# Altium project wifi-module-v02.PrjPcb (part 1 of 2)
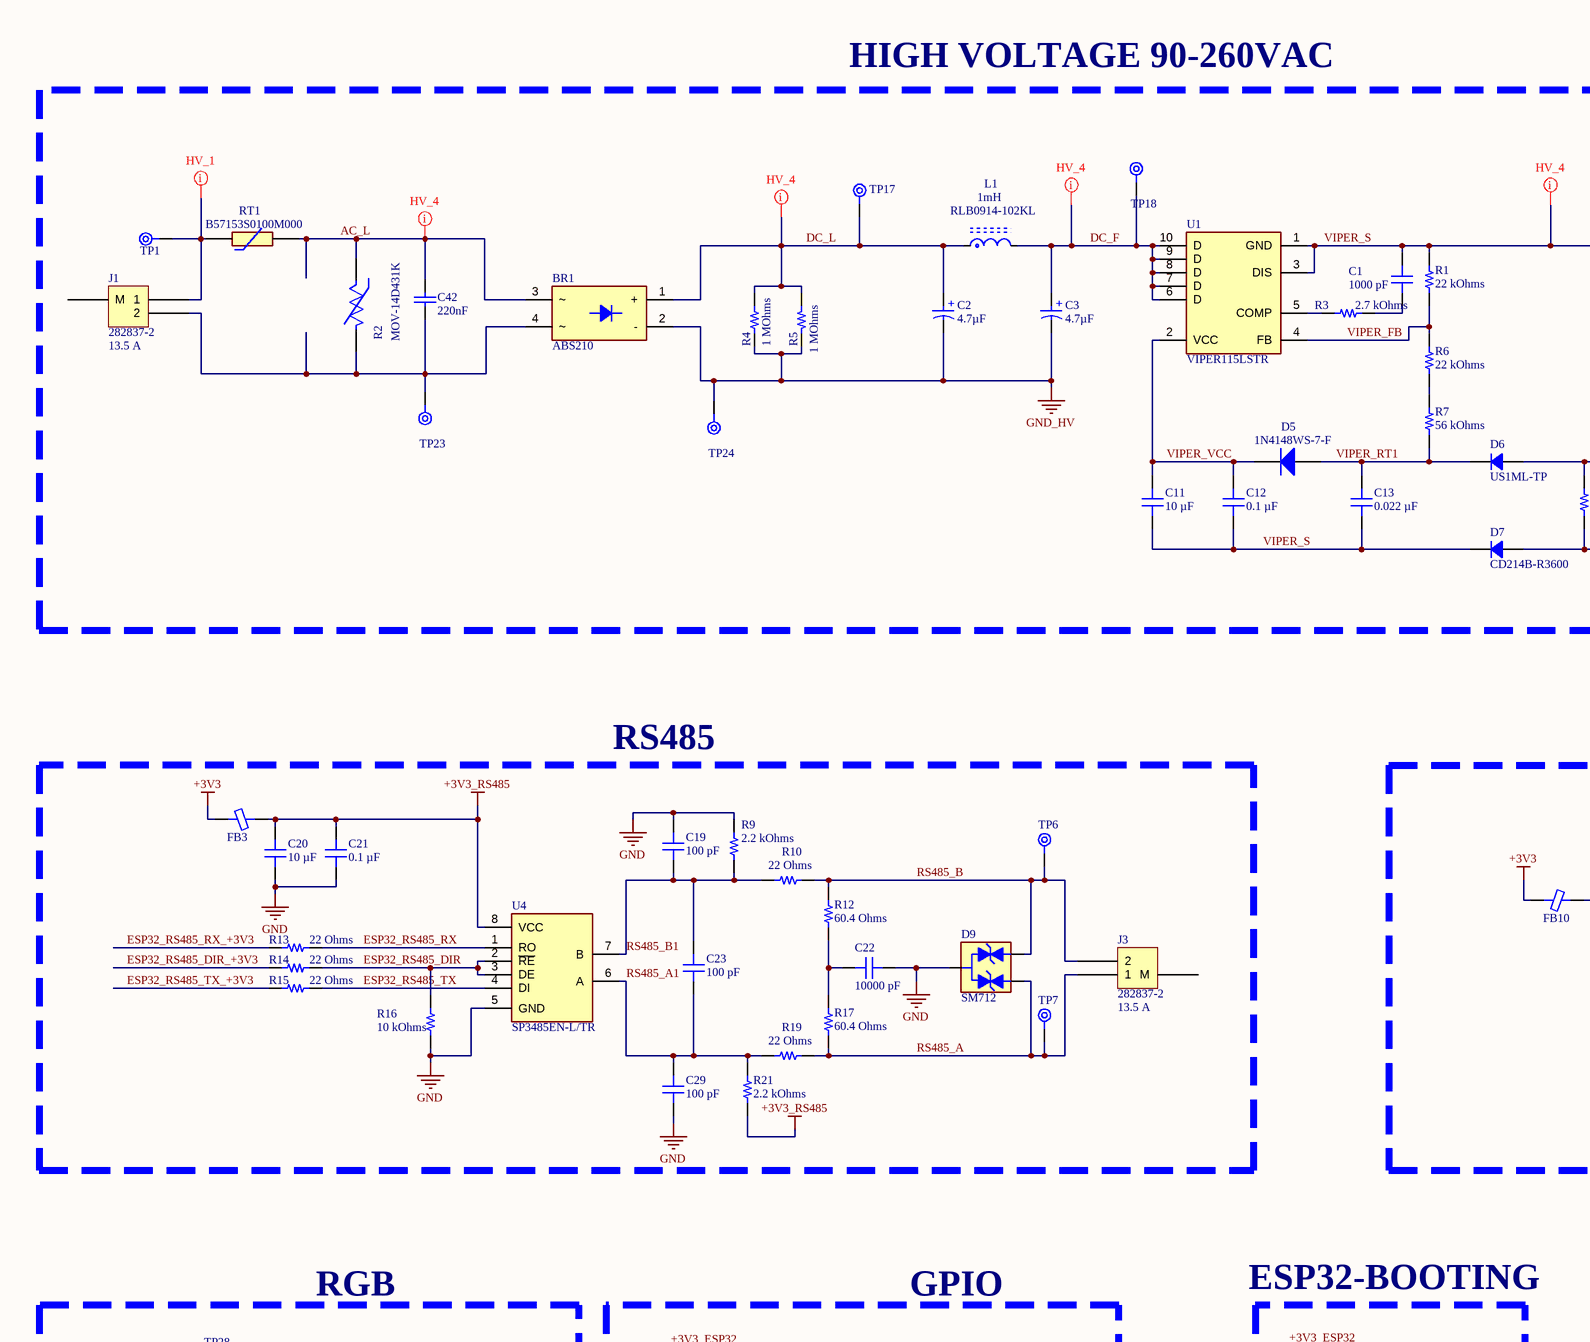
[diagram p0: wifi-module.SchDoc, top left]
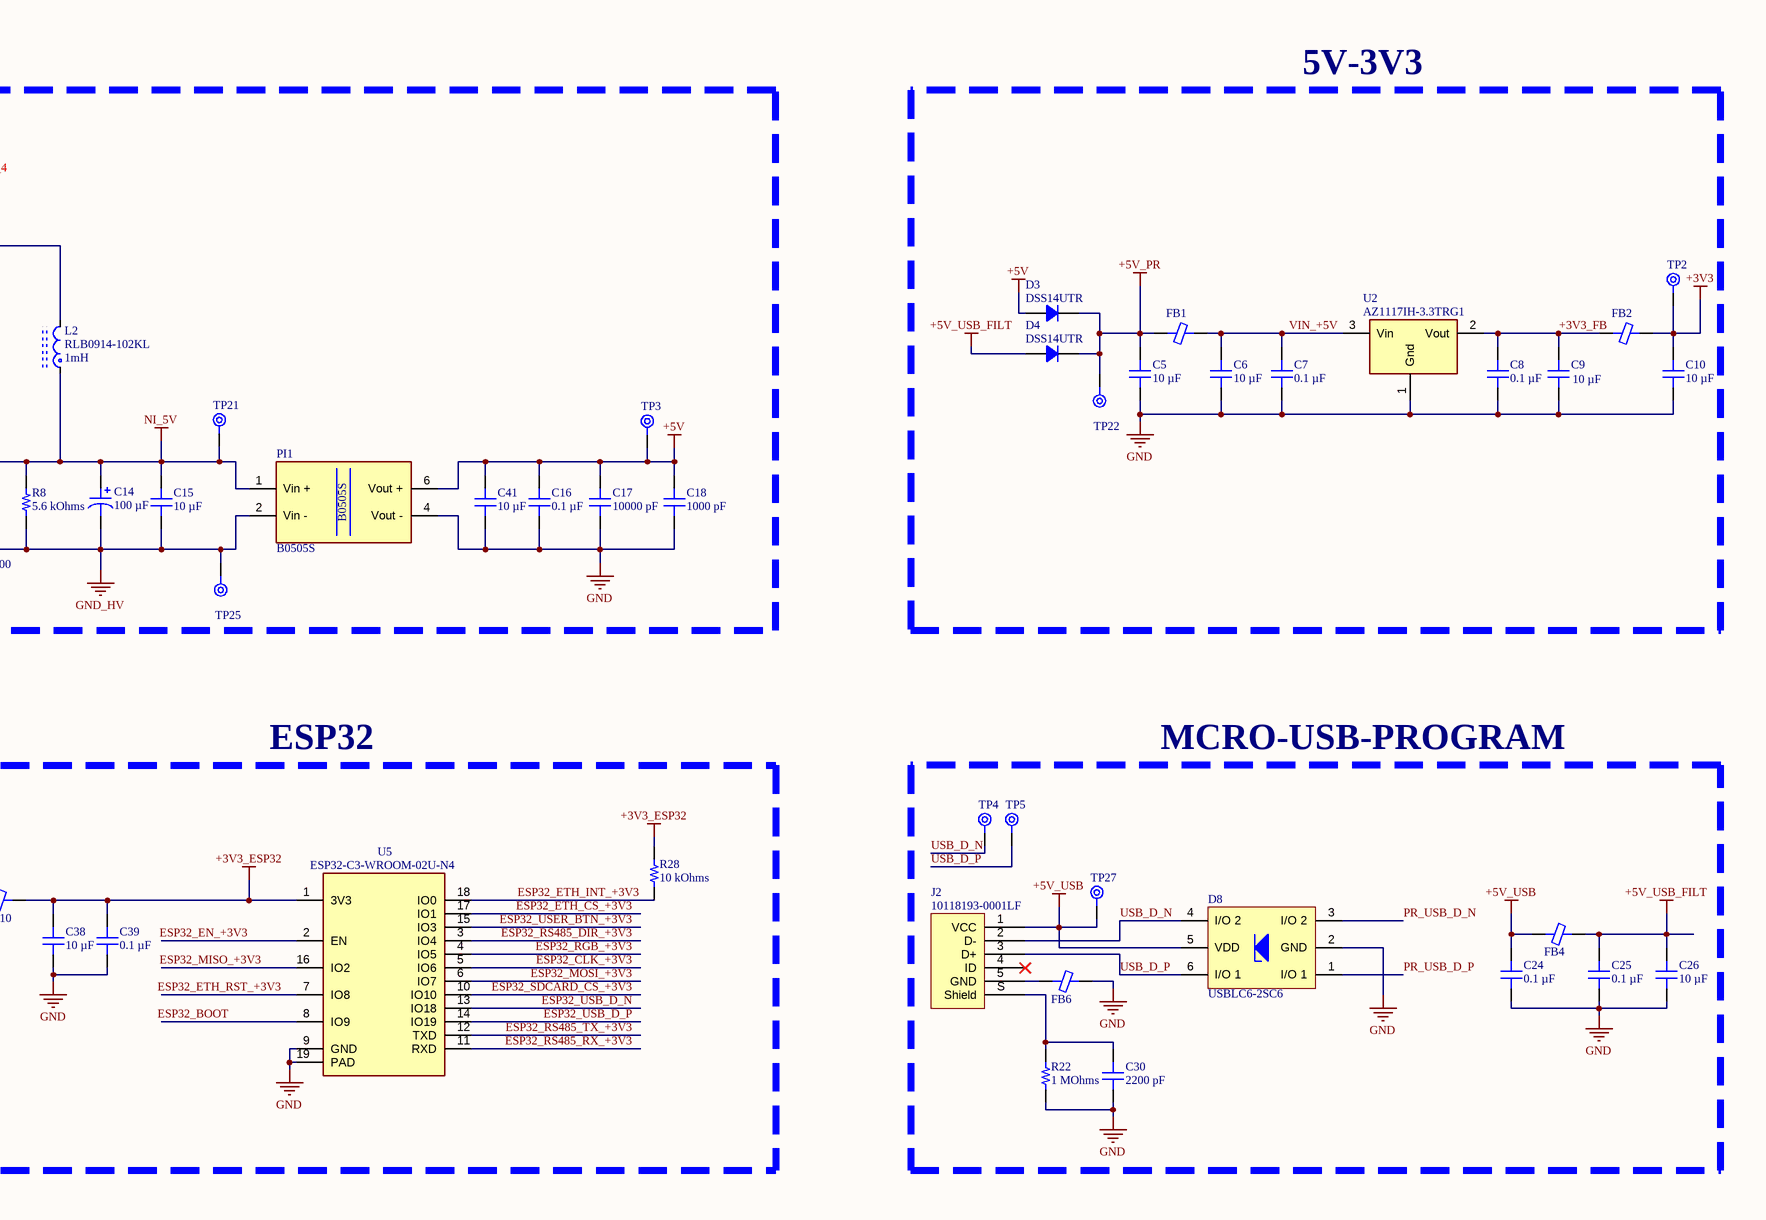
[diagram p1: wifi-module.SchDoc, top right]
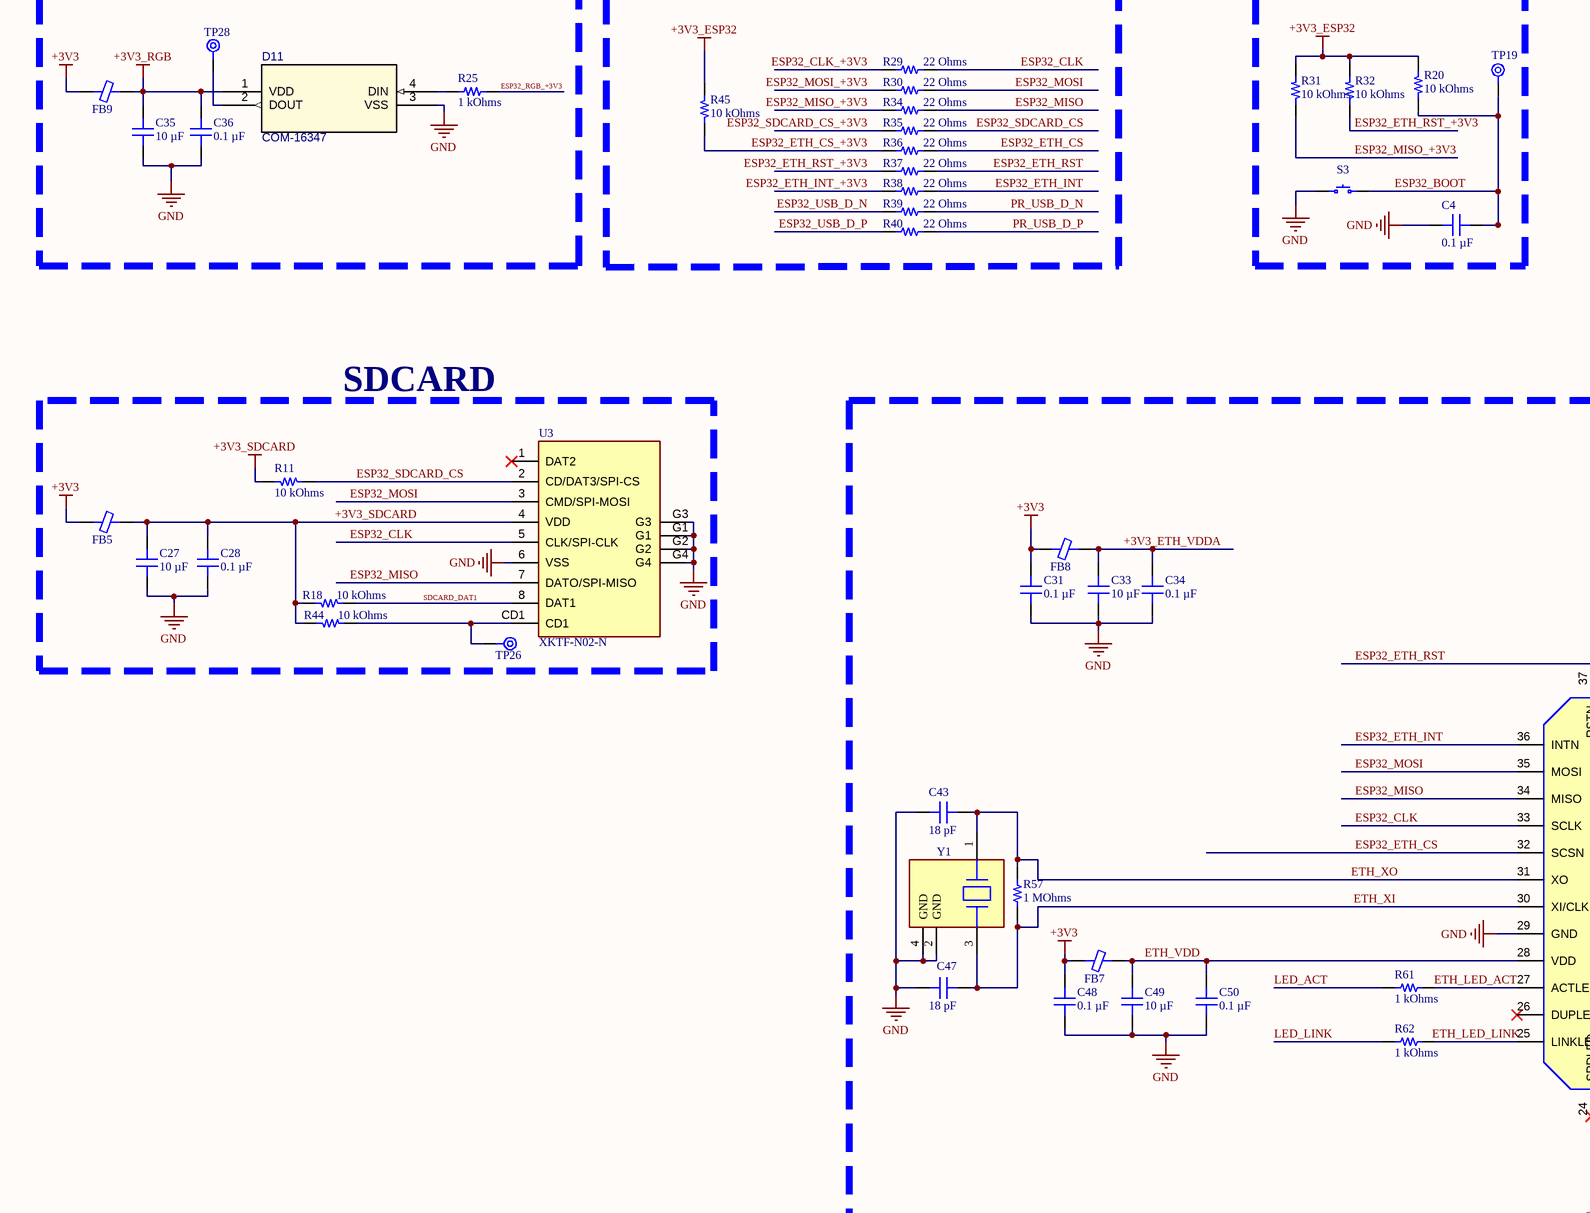
[diagram p2: wifi-module.SchDoc, bottom left]
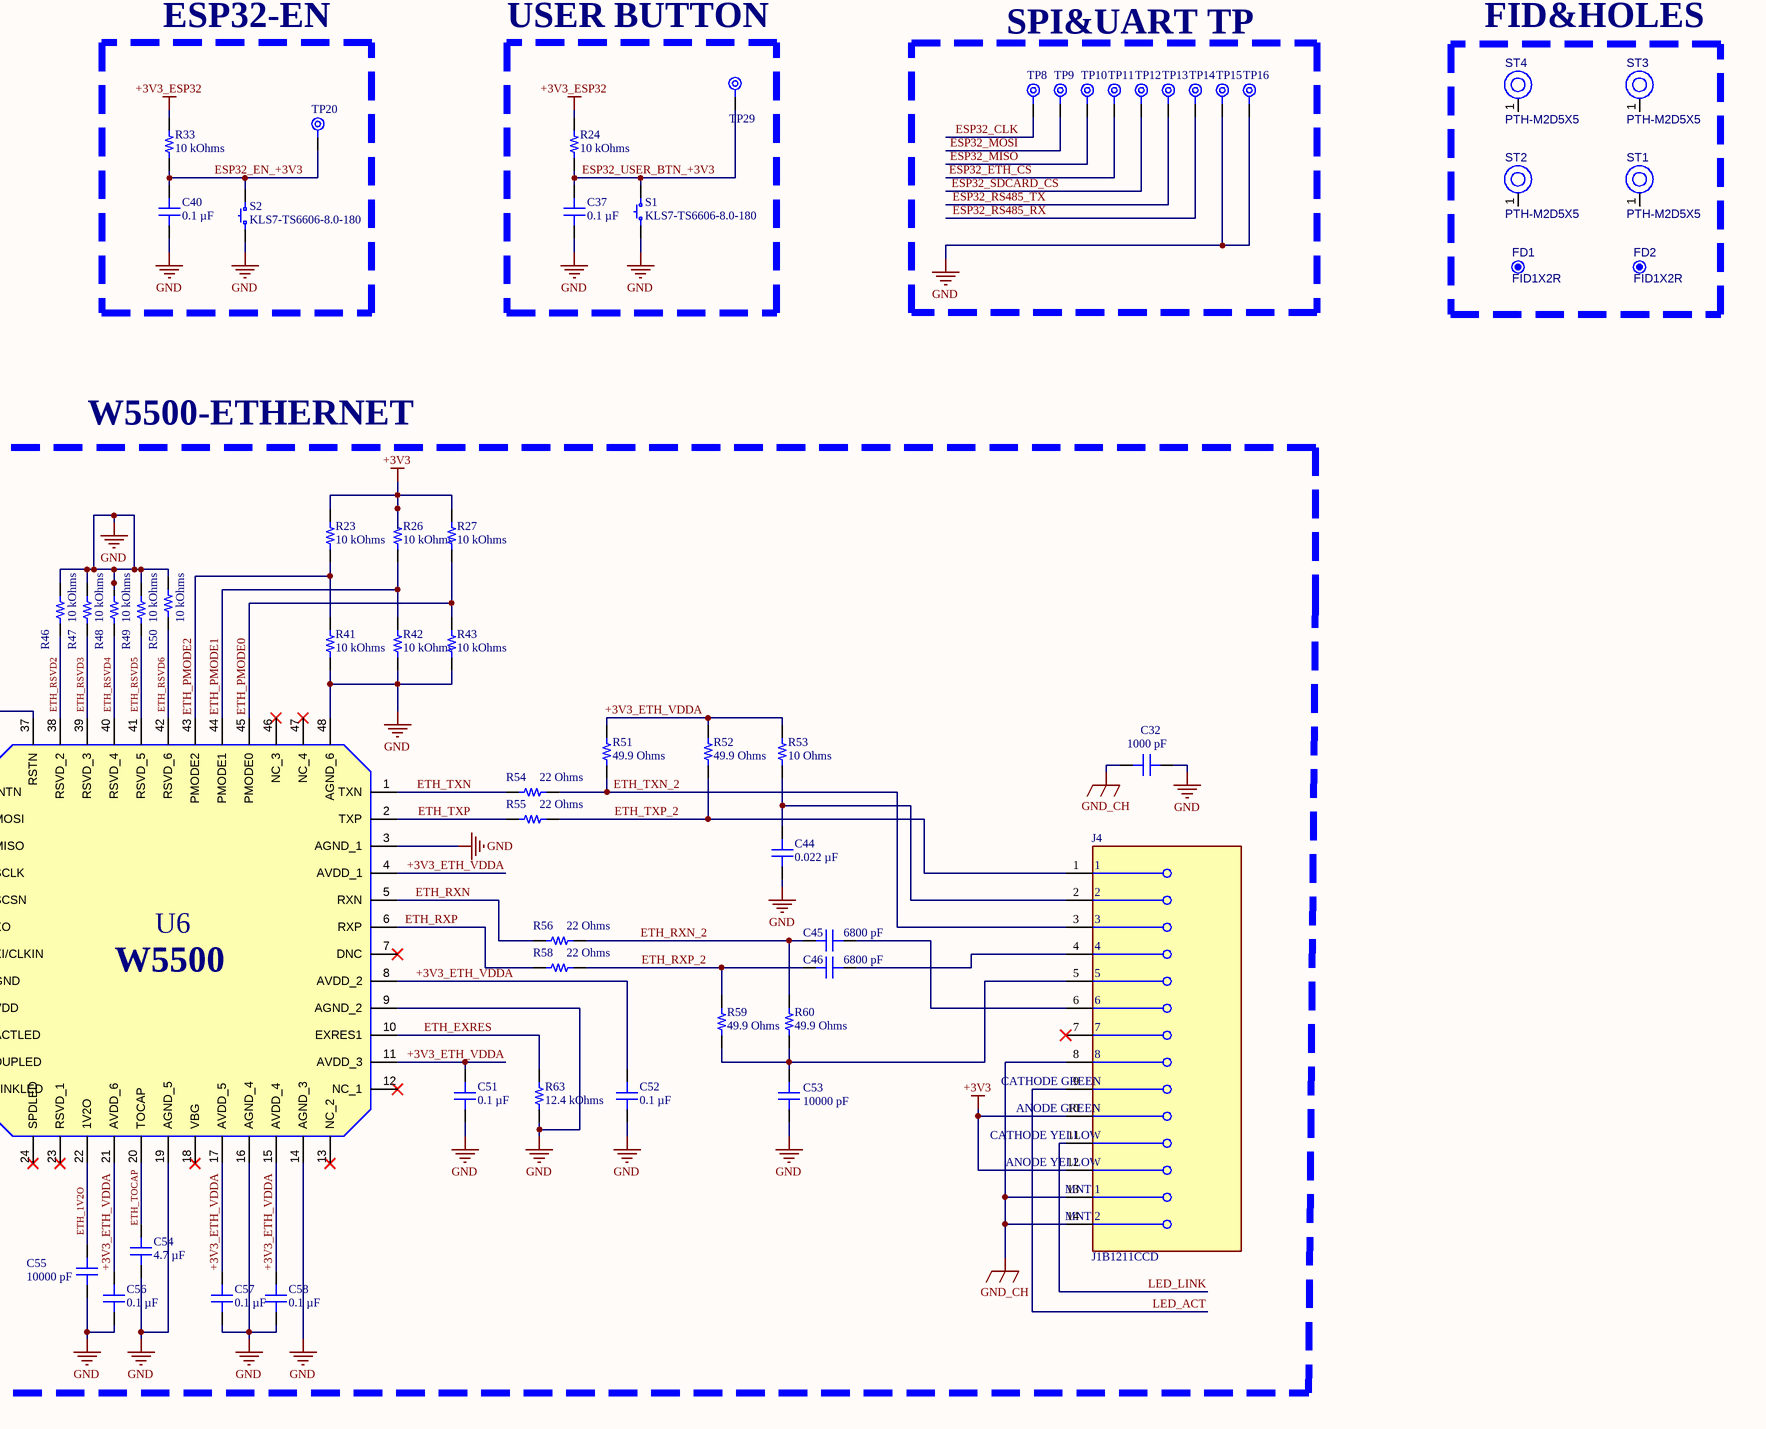
[diagram p3: wifi-module.SchDoc, bottom right]
1 sheet, 193 parts. Net scope: global (net labels, ports and power ports of the same name join across sheets).
Board file: wifi-module.PcbDoc

## Sheet wifi-module.SchDoc: EURO POWER WIFI
size 685 x 558 mm; CompanyName: DANNIE.CC; Revision: v1.0; SheetNumber: 1; SheetTotal: 1; SPICEModelCacheQCMYQEOC: <root> / <DocumentId>QCMYQEOC</DocumentId> / <CacheFrame Number="0"> / <Model Name="890324024002_220nf" Kind="CKT"> / <Text>******* / .subckt 890324024002_220nF 1 2 / Rser 1 3 0.055 / Lser 2 4 0.000000004818 / C1 3 4 0.00000022 / Rpar 3 4 30000000000 / .ends 890324024002_220nF</Text> / </Model> / <Model Name="860011374005_4.7uf" Kind="CKT"> / <Text>******* / .subckt 860011374005_4.7uF 1 2 / Rser 1 3 1.07032089826 / Lser 2 4 5.304520543E-09 / C1 3 4 0.0000047 / Rpar 3 4 21276595.7446809 / .ends 860011374005_4.7uF</Text> / </Model> / </CacheFrame> / </root>

### Parts
BR1  ABS210  [SOP400P630X160-4N]
C1  value 1000 pF  [CAP 0603_1608]  (hidden comment: C0603C102K5RACAUTO7411)
C2  value 4.7µF  [WCAP-ATG8_D8H11.5]  (hidden comment: 860011374005)
C3  value 4.7µF  [WCAP-ATG8_D8H11.5]  (hidden comment: 860011374005)
C4  value 0.1 µF  [CAP 0603_1608]  (hidden comment: CC0603JRX7R9BB104)
C5  value 10 µF  [CAP 0805_2012]  (hidden comment: CL21A106KAYNNNE)
C6  value 10 µF  [CAP 0805_2012]  (hidden comment: CL21A106KAYNNNE)
C7  value 0.1 µF  [CAP 0603_1608]  (hidden comment: CC0603JRX7R9BB104)
C8  value 0.1 µF  [CAP 0603_1608]  (hidden comment: CC0603JRX7R9BB104)
C9  value 10 µF  [CAP 0805_2012]  (hidden comment: CL21A106KAYNNNE)
C10  value 10 µF  [CAP 0805_2012]  (hidden comment: CL21A106KAYNNNE)
C11  value 10 µF  [CAP 0805_2012]  (hidden comment: CL21A106KAYNNNE)
C12  value 0.1 µF  [CAP 0603_1608]  (hidden comment: CC0603JRX7R9BB104)
C13  value 0.022 µF  [CAP 0603_1608]  (hidden comment: CL10B223KB8NNNC)
C14  value 100 µF  [CAP ALSMD POLY 8.3MM H6.0MM]  (hidden comment: A768KE107M1VLAE036)
C15  value 10 µF  [CAP 0805_2012]  (hidden comment: CL21A106KAYNNNE)
C16  value 0.1 µF  [CAP 0603_1608]  (hidden comment: CC0603JRX7R9BB104)
C17  value 10000 pF  [CAP 0603_1608]  (hidden comment: CL10B103KB8NNNC)
C18  value 1000 pF  [CAP 0603_1608]  (hidden comment: C0603C102K5RACAUTO7411)
C19  value 100 pF  [CAP 0603_1608]  (hidden comment: CL10C101JB81PNC)
C20  value 10 µF  [CAP 0603_1608]  (hidden comment: CL10A106MQ8NNNC)
C21  value 0.1 µF  [CAP 0603_1608]  (hidden comment: CC0603JRX7R9BB104)
C22  value 10000 pF  [CAP 0603_1608]  (hidden comment: CL10B103KB8NNNC)
C23  value 100 pF  [CAP 0603_1608]  (hidden comment: CL10C101JB81PNC)
C24  value 0.1 µF  [CAP 0603_1608]  (hidden comment: CC0603JRX7R9BB104)
C25  value 0.1 µF  [CAP 0603_1608]  (hidden comment: CC0603JRX7R9BB104)
C26  value 10 µF  [CAP 0805_2012]  (hidden comment: CL21A106KAYNNNE)
C27  value 10 µF  [CAP 0603_1608]  (hidden comment: CL10A106MQ8NNNC)
C28  value 0.1 µF  [CAP 0603_1608]  (hidden comment: CC0603JRX7R9BB104)
C29  value 100 pF  [CAP 0603_1608]  (hidden comment: CL10C101JB81PNC)
C30  value 2200 pF  [CAP 1206_3216 - 0.8MM]  (hidden comment: C1206X222KGRAC7800)
C31  value 0.1 µF  [CAP 0603_1608]  (hidden comment: CC0603JRX7R9BB104)
C32  value 1000 pF  [CAP 1206_3216 - 0.8MM]  (hidden comment: VPDD202W102K1GV001E)
C33  value 10 µF  [CAP 0603_1608]  (hidden comment: CL10A106MQ8NNNC)
C34  value 0.1 µF  [CAP 0603_1608]  (hidden comment: CC0603JRX7R9BB104)
C35  value 10 µF  [CAP 0603_1608]  (hidden comment: CL10A106MQ8NNNC)
C36  value 0.1 µF  [CAP 0603_1608]  (hidden comment: CC0603JRX7R9BB104)
C37  value 0.1 µF  [CAP 0603_1608]  (hidden comment: CC0603JRX7R9BB104)
C38  value 10 µF  [CAP 0603_1608]  (hidden comment: CL10A106MQ8NNNC)
C39  value 0.1 µF  [CAP 0603_1608]  (hidden comment: CC0603JRX7R9BB104)
C40  value 0.1 µF  [CAP 0603_1608]  (hidden comment: CC0603JRX7R9BB104)
C41  value 10 µF  [CAP 0805_2012]  (hidden comment: CL21A106KAYNNNE)
C42  value 220nF  [WCAP-FTX2_L15W7H12.5]  (hidden comment: 890324024002)
C43  value 18 pF  [CAP 0603_1608]  (hidden comment: C0603C180K5HACAUTO)
C44  value 0.022 µF  [CAP 0603_1608]  (hidden comment: C0603C223M5RACAUTO)
C45  value 6800 pF  [CAP 0603_1608]  (hidden comment: C0603C682K5RAC7411)
C46  value 6800 pF  [CAP 0603_1608]  (hidden comment: C0603C682K5RAC7411)
C47  value 18 pF  [CAP 0603_1608]  (hidden comment: C0603C180K5HACAUTO)
C48  value 0.1 µF  [CAP 0603_1608]  (hidden comment: CC0603JRX7R9BB104)
C49  value 10 µF  [CAP 0603_1608]  (hidden comment: CL10A106MQ8NNNC)
C50  value 0.1 µF  [CAP 0603_1608]  (hidden comment: CC0603JRX7R9BB104)
C51  value 0.1 µF  [CAP 0603_1608]  (hidden comment: CC0603JRX7R9BB104)
C52  value 0.1 µF  [CAP 0603_1608]  (hidden comment: CC0603JRX7R9BB104)
C53  value 10000 pF  [CAP 0603_1608]  (hidden comment: CL10B103KB8NNNC)
C54  value 4.7 µF  [CAP 1206_3216 - 0.8MM]  (hidden comment: CL31B475KBHNNNE)
C55  value 10000 pF  [CAP 0603_1608]  (hidden comment: CL10B103KB8NNNC)
C56  value 0.1 µF  [CAP 0603_1608]  (hidden comment: CC0603JRX7R9BB104)
C57  value 0.1 µF  [CAP 0603_1608]  (hidden comment: CC0603JRX7R9BB104)
C58  value 0.1 µF  [CAP 0603_1608]  (hidden comment: CC0603JRX7R9BB104)
D3  DSS14UTR  [SOD123F]
D4  DSS14UTR  [SOD123F]
D5  1N4148WS-7-F  [DIOD-SOD323-2-A_V]
D6  US1ML-TP  [DO214AC SMA]
D7  CD214B-R3600  [DO214AA SMB]
D8  USBLC6-2SC6  [STM-SOT23-6L_V]
D9  SM712  [SOT-23-3]
D11  COM-16347  [COM-16347-Footprint-1]
FB1  MPZ1608S101ATAH0  [FER 0603_1608]  (value not drawn)
FB2  MPZ1608S101ATAH0  [FER 0603_1608]  (value not drawn)
FB3  MPZ1608S101ATAH0  [FER 0603_1608]  (value not drawn)
FB4  MPZ1608S101ATAH0  [FER 0603_1608]  (value not drawn)
FB5  MPZ1608S101ATAH0  [FER 0603_1608]  (value not drawn)
FB6  MPZ1608S101ATAH0  [FER 0603_1608]  (value not drawn)
FB7  MPZ1608S101ATAH0  [FER 0603_1608]  (value not drawn)
FB8  MPZ1608S101ATAH0  [FER 0603_1608]  (value not drawn)
FB9  MPZ1608S101ATAH0  [FER 0603_1608]  (value not drawn)
FB10  MPZ1608S101ATAH0  [FER 0603_1608]  (value not drawn)
FD1  FID1X2R  [FID1X2R]  (no BOM)
FD2  FID1X2R  [FID1X2R]  (no BOM)
J1  282837-2  Current: 13.5 A  [TE 282837-2]
J2  10118193-0001LF  [FCI USB 10118193-0001LF]
J3  282837-2  Current: 13.5 A  [TE 282837-2]
J4  J1B1211CCD  [FP-J1B1211CCD-MFG]
L1  RLB0914-102KL  Inductance: 1mH  [FP-RLB0914-MFG]
L2  RLB0914-102KL  Inductance: 1mH  [FP-RLB0914-MFG]
PI1  B0505S  [B0505S]
R1  value 22 kOhms  [RES 0603_1608]  (hidden comment: RC0603FR-0722KL)
R2  MOV-14D431K  [FP-MOV-14D431K-MFG]
R3  value 2.7 kOhms  [RES 0603_1608]  (hidden comment: RC0603FR-072K7L)
R4  value 1 MOhms  [RES 2512_6432]  (hidden comment: RMCF2512JT1M00)
R5  value 1 MOhms  [RES 2512_6432]  (hidden comment: RMCF2512JT1M00)
R6  value 22 kOhms  [RES 0603_1608]  (hidden comment: RC0603FR-0722KL)
R7  value 56 kOhms  [RES 0603_1608]  (hidden comment: RC0603FR-0756KL)
R8  value 5.6 kOhms  [RES 0603_1608]  (hidden comment: RC0603FR-075K6L)
R9  value 2.2 kOhms  [RES 0603_1608]  (hidden comment: RC0603FR-072K2L)
R10  value 22 Ohms  [RES 0603_1608]  (hidden comment: RC0603FR-0722RL)
R11  value 10 kOhms  [RES 0603_1608]  (hidden comment: RC0603FR-0710KL)
R12  value 60.4 Ohms  [RES 0603_1608]  (hidden comment: RC0603FR-0760R4L)
R13  value 22 Ohms  [RES 0603_1608]  (hidden comment: RC0603FR-0722RL)
R14  value 22 Ohms  [RES 0603_1608]  (hidden comment: RC0603FR-0722RL)
R15  value 22 Ohms  [RES 0603_1608]  (hidden comment: RC0603FR-0722RL)
R16  value 10 kOhms  [RES 0603_1608]  (hidden comment: RC0603FR-0710KL)
R17  value 60.4 Ohms  [RES 0603_1608]  (hidden comment: RC0603FR-0760R4L)
R18  value 10 kOhms  [RES 0603_1608]  (hidden comment: RC0603FR-0710KL)
R19  value 22 Ohms  [RES 0603_1608]  (hidden comment: RC0603FR-0722RL)
R20  value 10 kOhms  [RES 0603_1608]  (hidden comment: RC0603FR-0710KL)
R21  value 2.2 kOhms  [RES 0603_1608]  (hidden comment: RC0603FR-072K2L)
R22  value 1 MOhms  [RES 1206_3216]  (hidden comment: RC1206FR-071ML)
R23  value 10 kOhms  [RES 0603_1608]  (hidden comment: RC0603FR-0710KL)
R24  value 10 kOhms  [RES 0603_1608]  (hidden comment: RC0603FR-0710KL)
R25  value 1 kOhms  [RES 0603_1608]  (hidden comment: RC0603FR-071KL)
R26  value 10 kOhms  [RES 0603_1608]  (hidden comment: RC0603FR-0710KL)
R27  value 10 kOhms  [RES 0603_1608]  (hidden comment: RC0603FR-0710KL)
R28  value 10 kOhms  [RES 0603_1608]  (hidden comment: RC0603FR-0710KL)
R29  value 22 Ohms  [RES 0603_1608]  (hidden comment: RC0603FR-0722RL)
R30  value 22 Ohms  [RES 0603_1608]  (hidden comment: RC0603FR-0722RL)
R31  value 10 kOhms  [RES 0603_1608]  (hidden comment: RC0603FR-0710KL)
R32  value 10 kOhms  [RES 0603_1608]  (hidden comment: RC0603FR-0710KL)
R33  value 10 kOhms  [RES 0603_1608]  (hidden comment: RC0603FR-0710KL)
R34  value 22 Ohms  [RES 0603_1608]  (hidden comment: RC0603FR-0722RL)
R35  value 22 Ohms  [RES 0603_1608]  (hidden comment: RC0603FR-0722RL)
R36  value 22 Ohms  [RES 0603_1608]  (hidden comment: RC0603FR-0722RL)
R37  value 22 Ohms  [RES 0603_1608]  (hidden comment: RC0603FR-0722RL)
R38  value 22 Ohms  [RES 0603_1608]  (hidden comment: RC0603FR-0722RL)
R39  value 22 Ohms  [RES 0603_1608]  (hidden comment: RC0603FR-0722RL)
R40  value 22 Ohms  [RES 0603_1608]  (hidden comment: RC0603FR-0722RL)
R41  value 10 kOhms  [RES 0603_1608]  (hidden comment: RC0603FR-0710KL)
R42  value 10 kOhms  [RES 0603_1608]  (hidden comment: RC0603FR-0710KL)
R43  value 10 kOhms  [RES 0603_1608]  (hidden comment: RC0603FR-0710KL)
R44  value 10 kOhms  [RES 0603_1608]  (hidden comment: RC0603FR-0710KL)
R45  value 10 kOhms  [RES 0603_1608]  (hidden comment: RC0603FR-0710KL)
R46  value 10 kOhms  [RES 0603_1608]  (hidden comment: RC0603FR-0710KL)
R47  value 10 kOhms  [RES 0603_1608]  (hidden comment: RC0603FR-0710KL)
R48  value 10 kOhms  [RES 0603_1608]  (hidden comment: RC0603FR-0710KL)
R49  value 10 kOhms  [RES 0603_1608]  (hidden comment: RC0603FR-0710KL)
R50  value 10 kOhms  [RES 0603_1608]  (hidden comment: RC0603FR-0710KL)
R51  value 49.9 Ohms  [RES 0603_1608]  (hidden comment: RC0603FR-0749R9L)
R52  value 49.9 Ohms  [RES 0603_1608]  (hidden comment: RC0603FR-0749R9L)
R53  value 10 Ohms  [RES 0603_1608]  (hidden comment: RC0603FR-0710RL)
R54  value 22 Ohms  [RES 0603_1608]  (hidden comment: RC0603FR-0722RL)
R55  value 22 Ohms  [RES 0603_1608]  (hidden comment: RC0603FR-0722RL)
R56  value 22 Ohms  [RES 0603_1608]  (hidden comment: RC0603FR-0722RL)
R57  value 1 MOhms  [RES 0603_1608]  (hidden comment: RC0603FR-071ML)
R58  value 22 Ohms  [RES 0603_1608]  (hidden comment: RC0603FR-0722RL)
R59  value 49.9 Ohms  [RES 0603_1608]  (hidden comment: RC0603FR-0749R9L)
R60  value 49.9 Ohms  [RES 0603_1608]  (hidden comment: RC0603FR-0749R9L)
R61  value 1 kOhms  [RES 0603_1608]  (hidden comment: RC0603FR-071KL)
R62  value 1 kOhms  [RES 0603_1608]  (hidden comment: RC0603FR-071KL)
R63  value 12.4 kOhms  [RES 0603_1608]  (hidden comment: RC0603FR-0712K4L)
RT1  B57153S0100M000  [B57153S0100M000-Footprint-1]
S1  KLS7-TS6606-8.0-180  [KLS7TS660680180]
S2  KLS7-TS6606-8.0-180  [KLS7TS660680180]
S3  KLS7-TS6606-8.0-180  [KLS7TS660680180]  (value not drawn)
ST1  PTH-M2D5X5  [PTH-M2D5X5]
ST2  PTH-M2D5X5  [PTH-M2D5X5]
ST3  PTH-M2D5X5  [PTH-M2D5X5]
ST4  PTH-M2D5X5  [PTH-M2D5X5]
TP1  TPAD1200  [TPAD1200]  (value not drawn)
TP2  TPAD1200  [TPAD1200]  (value not drawn)
TP3  TPAD1200  [TPAD1200]  (value not drawn)
TP4  TPAD1200  [TPAD1200]  (value not drawn)
TP5  TPAD1200  [TPAD1200]  (value not drawn)
TP6  TPAD1200  [TPAD1200]  (value not drawn)
TP7  TPAD1200  [TPAD1200]  (value not drawn)
TP8  TPAD1200  [TPAD1200]  (value not drawn)
TP9  TPAD1200  [TPAD1200]  (value not drawn)
TP10  TPAD1200  [TPAD1200]  (value not drawn)
TP11  TPAD1200  [TPAD1200]  (value not drawn)
TP12  TPAD1200  [TPAD1200]  (value not drawn)
TP13  TPAD1200  [TPAD1200]  (value not drawn)
TP14  TPAD1200  [TPAD1200]  (value not drawn)
TP15  TPAD1200  [TPAD1200]  (value not drawn)
TP16  TPAD1200  [TPAD1200]  (value not drawn)
TP17  TPAD1200  [TPAD1200]  (value not drawn)
TP18  TPAD1200  [TPAD1200]  (value not drawn)
TP19  TPAD1200  [TPAD1200]  (value not drawn)
TP20  TPAD1200  [TPAD1200]  (value not drawn)
TP21  TPAD1200  [TPAD1200]  (value not drawn)
TP22  TPAD1200  [TPAD1200]  (value not drawn)
TP23  TPAD1200  [TPAD1200]  (value not drawn)
TP24  TPAD1200  [TPAD1200]  (value not drawn)
TP25  TPAD1200  [TPAD1200]  (value not drawn)
TP26  TPAD1200  [TPAD1200]  (value not drawn)
TP27  TPAD1200  [TPAD1200]  (value not drawn)
TP28  TPAD1200  [TPAD1200]  (value not drawn)
TP29  TPAD1200  [TPAD1200]  (value not drawn)
U1  VIPER115LSTR  [VIPER115LSTR-Footprint-1]
U2  AZ1117IH-3.3TRG1  [SOT-223-3]
U3  XKTF-N02-N  [MicroSD]
U4  SP3485EN-L/TR  [SP3485EN-L_TR-Footprint-1]
U5  ESP32-C3-WROOM-02U-N4  [ESP32C3WROOM02UN4]
U6  W5500  [48-LQFP (7x7)]
Y1  ABM8G-25.000MHZ-18-D2Y-T  [FP-ABM8G-MFG]  (value not drawn)

### Blocks framed on the sheet
HIGH VOLTAGE 90-260VAC: BR1 C1-C3 C11-C18 C41 C42 D5-D7 J1 L1 L2 PI1 R1-R8 RT1 TP1 TP3 TP17 TP18 TP21 TP23-TP25 U1
RS485: C19-C23 C29 D9 FB3 J3 R9 R10 R12-R17 R19 R21 TP6 TP7 U4
ESP32: C38 C39 FB10 R28 U5
MCRO-USB-PROGRAM: C24-C26 C30 D8 FB4 FB6 J2 R22 TP4 TP5 TP27
RGB: C35 C36 D11 FB9 R25 TP28
GPIO: R29 R30 R34-R40 R45
ESP32-EN: C40 R33 S2 TP20
USER BUTTON: C37 R24 S1 TP29
SPI&UART TP: TP8-TP16
FID&HOLES: FD1 FD2 ST1-ST4
SDCARD: C27 C28 FB5 R11 R18 R44 TP26 U3
W5500-ETHERNET: C31-C34 C43-C58 FB7 FB8 J4 R23 R26 R27 R41-R43 R46-R63 U6 Y1

### Nets
+3V3: C10.2 C31.2 C48.2 FB2.2 FB3.2 FB5.1 FB7.1 FB8.1 FB9.1 FB10.1 J4.10(ANODE_GREEN) J4.12(ANODE_YELLOW) R23.2 R26.2 R27.2 TP2.1(TP)
+3V3_ESP32: C38.2 C39.2 FB10.2 R20.1 R24.2 R28.2 R31.1 R32.1 R33.2 R45.2 U5.1(3V3)
+3V3_RGB: C35.2 C36.2 D11.1(VDD) FB9.2
+3V3_RS485: C20.2 C21.2 FB3.1 R21.1 U4.8(VCC)
+3V3_SDCARD: C27.2 C28.2 FB5.2 R11.1 R18.1 R44.1 U3.4(VDD)
+5V: C16.2 C17.2 C18.2 C41.2 D3.1 PI1.6(Vout_+) TP3.1(TP)
+5V_PR: C5.2 D3.2 D4.2 FB1.1 TP22.1(TP)
+5V_USB: C24.2 D8.5(VDD) FB4.1 J2.1(VCC) TP27.1(TP)
+5V_USB_FILT: C25.2 C26.2 D4.1 FB4.2
GND: C4.1 C5.1 C6.1 C7.1 C8.1 C9.1 C10.1 C16.1 C17.1 C18.1 C19.2 C20.1 C21.1 C22.1 C24.1 C25.1 C26.1 C27.1 C28.1 C29.1 C30.1 C31.1 C32.1 C33.1 C34.1 C35.1 C36.1 C37.1 C38.1 C39.1 C40.1 C41.1 C43.1 C44.1 C47.1 C48.1 C49.1 C50.1 C51.1 C52.1 C53.1 C54.1 C55.1 C56.1 C57.1 C58.1 D8.2(GND) D9.3(CC) D11.3(VSS) FB6.2 PI1.4(Vout_-) R9.2 R16.2 R22.1 R41.1 R42.1 R43.1 R46.2 R47.2 R48.2 R49.2 R50.2 R63.1 S1.1 S2.1 S3.1 TP15.1(TP) TP16.1(TP) U2.1(Gnd) U3.6(VSS) U3.G1 U3.G2 U3.G3 U3.G4 U4.5(GND) U5.9(GND) U5.19(PAD) U6.3(AGND_1) U6.9(AGND_2) U6.14(AGND_3) U6.16(AGND_4) U6.19(AGND_5) U6.29(GND) U6.48(AGND_6) Y1.2(GND) Y1.4(GND)
GND_CH: C32.2 J4.8 J4.13(MNT_1) J4.14(MNT_2)
GND_HV: BR1.2(-) C2.2(N) C3.2(N) C14.2 C15.1 D7.1 PI1.2(Vin_-) R4.1 R5.1 R8.1 TP24.1(TP) TP25.1(TP)
NI_5V: C14.1 C15.2 D6.1 L2.1 PI1.1(Vin_+) R8.2 TP21.1(TP)
+3V3_ETH_VDDA: C33.2 C34.2 C51.2 C52.2 C56.2 C57.2 C58.2 FB8.2 R51.2 R52.2 R53.2 U6.4(AVDD_1) U6.8(AVDD_2) U6.11(AVDD_3) U6.15(AVDD_4) U6.17(AVDD_5) U6.21(AVDD_6)
+3V3_FB: C8.2 C9.2 FB2.1 U2.2(Vout)
AC_L: BR1.3 C42.1 R2.2 RT1.2
DC_F: C3.1(P) L1.2 TP18.1(TP) U1.6(D) U1.7(D) U1.8(D) U1.9(D) U1.10(D)
DC_L: BR1.1(+) C2.1(P) L1.1 R4.2 R5.2 TP17.1(TP)
ESP32_BOOT: C4.2 R20.2 S3.2 TP19.1(TP) U5.8(IO9)
ESP32_CLK: R29.2 TP8.1(TP) U3.5(CLK/SPI-CLK) U6.33(SCLK)
ESP32_CLK_+3V3: R29.1 U5.5(IO6)
ESP32_EN_+3V3: C40.2 R33.1 S2.2 TP20.1(TP) U5.2(EN)
ESP32_ETH_CS: R36.2 TP11.1(TP) U6.32(SCSN)
ESP32_ETH_CS_+3V3: R36.1 R45.1 U5.17(IO1)
ESP32_ETH_INT: R38.2 U6.36(INTN)
ESP32_ETH_INT_+3V3: R28.1 R38.1 U5.18(IO0)
ESP32_ETH_RST: R37.2 U6.37(RSTN)
ESP32_ETH_RST_+3V3: R32.2 R37.1 U5.7(IO8)
ESP32_MISO: R34.2 TP10.1(TP) U3.7(DATO/SPI-MISO) U6.34(MISO)
ESP32_MISO_+3V3: R31.2 R34.1 U5.16(IO2)
ESP32_MOSI: R30.2 TP9.1(TP) U3.3(CMD/SPI-MOSI) U6.35(MOSI)
ESP32_MOSI_+3V3: R30.1 U5.6(IO7)
ESP32_RGB_+3V3: R25.2 U5.4(IO5)
ESP32_RS485_DIR: R14.2 R16.1 U4.2(~{RE}) U4.3(DE)
ESP32_RS485_DIR_+3V3: R14.1 U5.3(IO4)
ESP32_RS485_RX: R13.2 TP14.1(TP) U4.1(RO)
ESP32_RS485_RX_+3V3: R13.1 U5.11(RXD)
ESP32_RS485_TX: R15.2 TP13.1(TP) U4.4(DI)
ESP32_RS485_TX_+3V3: R15.1 U5.12(TXD)
ESP32_SDCARD_CS: R11.2 R35.2 TP12.1(TP) U3.2(CD/DAT3/SPI-CS)
ESP32_SDCARD_CS_+3V3: R35.1 U5.10(IO10)
ESP32_USB_D_N: R39.1 U5.13(IO18)
ESP32_USB_D_P: R40.1 U5.14(IO19)
ESP32_USER_BTN_+3V3: C37.2 R24.1 S1.2 TP29.1(TP) U5.15(IO3)
ETH_1V2O: C55.2 U6.22(1V2O)
ETH_EXRES: R63.2 U6.10(EXRES1)
ETH_LED_ACT: R61.2 U6.27(ACTLED)
ETH_LED_LINK: R62.2 U6.25(LINKLED)
ETH_PMODE0: R27.1 R43.2 U6.45(PMODE0)
ETH_PMODE1: R26.1 R42.2 U6.44(PMODE1)
ETH_PMODE2: R23.1 R41.2 U6.43(PMODE2)
ETH_RSVD2: R46.1 U6.38(RSVD_2)
ETH_RSVD3: R47.1 U6.39(RSVD_3)
ETH_RSVD4: R48.1 U6.40(RSVD_4)
ETH_RSVD5: R49.1 U6.41(RSVD_5)
ETH_RSVD6: R50.1 U6.42(RSVD_6)
ETH_RXN: R56.1 U6.5(RXN)
ETH_RXN_2: C45.1 R56.2 R60.2
ETH_RXP: R58.1 U6.6(RXP)
ETH_RXP_2: C46.1 R58.2 R59.2
ETH_TOCAP: C54.2 U6.20(TOCAP)
ETH_TXN: R54.1 U6.1(TXN)
ETH_TXN_2: J4.3 R51.1 R54.2
ETH_TXP: R55.1 U6.2(TXP)
ETH_TXP_2: J4.1 R52.1 R55.2
ETH_VDD: C49.2 C50.2 FB7.2 U6.28(VDD)
ETH_XI: C47.2 R57.1 U6.30(XI/CLKIN) Y1.3
ETH_XO: C43.2 R57.2 U6.31(XO) Y1.1
LED_ACT: J4.9(CATHODE_GREEN) R61.1
LED_LINK: J4.11(CATHODE_YELLOW) R62.1
PR_USB_D_N: D8.3(I/O_2) R39.2
PR_USB_D_P: D8.1(I/O_1) R40.2
RS485_A: D9.2(C2) J3.1 R17.1 R19.2 TP7.1(TP)
RS485_A1: C23.1 C29.2 R19.1 R21.2 U4.6(A)
RS485_B: D9.1(C1) J3.2 R10.2 R12.2 TP6.1(TP)
RS485_B1: C19.1 C23.2 R9.1 R10.1 U4.7(B)
SDCARD_DAT1: R18.2 U3.8(DAT1)
USB_D_N: D8.4(I/O_2) J2.2(D-) TP4.1(TP)
USB_D_P: D8.6(I/O_1) J2.3(D+) TP5.1(TP)
VIN_+5V: C6.2 C7.2 FB1.2 U2.3(Vin)
VIPER_FB: R1.1 R6.2 U1.4(FB)
VIPER_RT1: C13.2 D5.1(A) D6.2 R7.1
VIPER_S: C1.2 C11.1 C12.1 C13.1 D7.2 L2.2 R1.2 U1.1(GND) U1.3(DIS)
VIPER_VCC: C11.2 C12.2 D5.2(K) U1.2(VCC)
NetBR1_4: BR1.4 C42.2 J1.2 R2.1 TP23.1(TP)
NetC1_1: C1.1 R3.2
NetC22_2: C22.2 R12.1 R17.2
NetC30_2: C30.2 J2.S(Shield) R22.2
NetC44_2: C44.2 J4.2 R53.1
NetC45_2: C45.2 J4.6
NetC46_2: C46.2 J4.4
NetC53_2: C53.2 J4.5 R59.1 R60.1
NetD11_2: D11.2(DOUT) TP28.1(TP)
NetD11_4: D11.4(DIN) R25.1
NetFB6_1: FB6.1 J2.5(GND)
NetJ1_1: J1.1 RT1.1 TP1.1(TP)
NetR3_1: R3.1 U1.5(COMP)
NetR6_1: R6.1 R7.2
NetR44_2: R44.2 TP26.1(TP) U3.CD1

Not connected (* = marked no-connect by the designer): J1 M; J2 4(ID)*; J3 M; J4 7*; ST1 1(H1); ST2 1(H1); ST3 1(H1); ST4 1(H1); U3 1(DAT2)*; U6 7(DNC)* 12(NC_1)* 13(NC_2)* 18(VBG)* 23(RSVD_1)* 24(SPDLED)* 26(DUPLED)* 46(NC_3)* 47(NC_4)*

### Layout directives
net class HIGH_VOLTAGE: AC_L, DC_F, DC_L, NetJ1_1, VIPER_S

### Notes on the sheet
- 5V-3V3
- ESP32-BOOTING
- DWG. NO.
- REV.
- SHT.
- REVISION
- DESCRIPTION
- DATE
- APPROVED
- THIS DOCUMENT AND THE DATA DISCLOSED HEREIN OR HEREWITH IS THE PROPERTY OF ALTIUM LIMITED AND MAY BE FREELY DISTRIBUTED IN WHOLE. NO RIGHTS ARE RESERVED OR EXPRESS OR IMPLIED WARANTEE GIVEN.
- ENG:
- DSN:
- APPROVALS
- PROJECT
- DOCUMENT REVISION:
- DESIGN ITEM:
- CHK:
- BOM:
- REFERENCE DOCUMENTS
- PROJECT REVISION:
- TITLE
- FAB DWG:
- PCB DWG:
- ASSY DWG:
- SCALE:
- SIZE
- D
- CAGE CODE
- FILE NAME
- DWG NO.
- SHEET
- OF
- REV
- (in symbol CMP-001-00289-1) +